# Altium schematic sheet BSheet3.SchDoc: =GlobalProjectName
size 209 x 297 mm; ApprovedBy: Утвердил; CheckedBy: Проверил; Author: Разработал; SheetNumber: 24; SheetTotal: 26; PageSetup: Record=PageOptions|CenterHorizontal=True|CenterVertical=True|PrintScale=1.00|XCorrection=1.00|YCorrection=1.00|PrintKind=1|BorderSize=5000000|LeftOffset=0|BottomOffset=0|Orientation=2|PaperLength=1000|PaperWidth=1000|Scale=100|PaperSource=15|PrintQuality=1200|MediaType=1|DitherType=10|PaperKind=A3|PrintScaleMode=1; Weight: -; ScaleFactor: -; NormInspection: Норм.Контр.
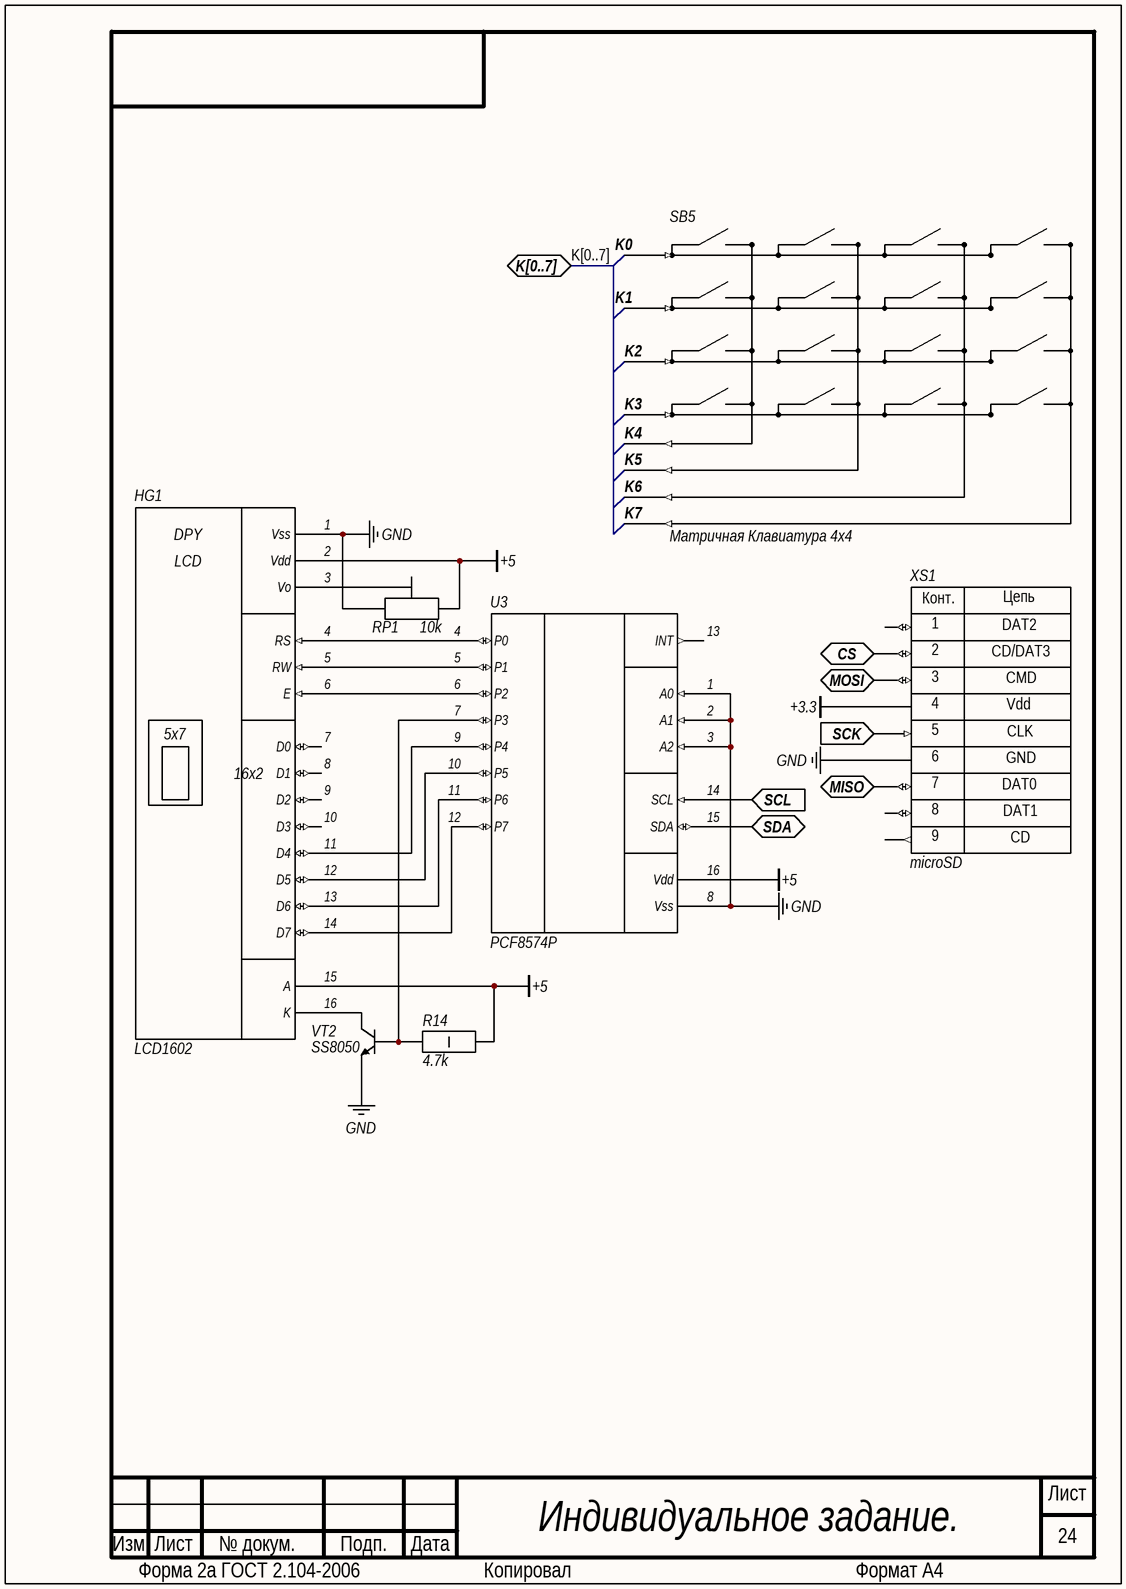
[diagram p0: BSheet3.SchDoc]

## Parts
HG1  LCD1602  [X PBS-16]
R14  4.7k  [R AXIAL-1W]
RP1  10k  [R ADJ-3296W]
SB5  Матричная Клавиатура 4x4  [X PLS-8]
U3  PCF8574P  [U DIP-16]
VT2  SS8050  [VT TO-92]
XS1  microSD  [X microSD]

## Ports
CS (bidir), K[0..7] (bidir), MISO (bidir), MOSI (bidir), SCK (in), SCL (in), SDA (bidir)

## Nets
+3.3: XS1.4(Vdd)
+5: HG1.2(Vdd) HG1.15(A) R14.1 RP1.1 U3.16(Vdd)
GND: HG1.1(Vss) RP1.3 U3.1(A0) U3.2(A1) U3.3(A2) U3.8(Vss) VT2.1(E) XS1.6(GND)
CS: XS1.2(CD/DAT3) ; port CS
K0: SB5.1
K1: SB5.2
K2: SB5.3
K3: SB5.4
K4: SB5.5
K5: SB5.6
K6: SB5.7
K7: SB5.8
MISO: XS1.7(DATA0) ; port MISO
MOSI: XS1.3(CMD) ; port MOSI
SCK: XS1.5(CLK) ; port SCK
SCL: U3.14(SCL) ; port SCL
SDA: U3.15(SDA) ; port SDA
NetHG1_3: HG1.3(Vo) RP1.2
NetHG1_4: HG1.4(RS) U3.4(P0)
NetHG1_5: HG1.5(RW) U3.5(P1)
NetHG1_6: HG1.6(E) U3.6(P2)
NetHG1_11: HG1.11(D4) U3.9(P4)
NetHG1_12: HG1.12(D5) U3.10(P5)
NetHG1_13: HG1.13(D6) U3.11(P6)
NetHG1_14: HG1.14(D7) U3.12(P7)
NetHG1_16: HG1.16(K) VT2.3(C)
NetR14_2: R14.2 U3.7(P3) VT2.2(B)

Not connected (* = marked no-connect by the designer): HG1 7(D0) 8(D1) 9(D2) 10(D3); U3 13(INT); XS1 1(DAT2) 8(DATA1)

## Buses and harness runs
bus K[0..7] = port K[0..7]

## Notes on the sheet
- Индивидуальное задание.
- Изм.
- Лист
- № докум.
- Подп.
- Дата
- Форма 2а ГОСТ 2.104-2006
- Копировал
- Формат А4
- (in symbol LCD HD44780) DPY
- (in symbol microSD) Цепь; Конт.; DAT0; DAT1; 9

## Library data of the parts
HG1 = LCD HD44780: Дисплей на основе контроллера HD44780.; ScreenResolution: 16x2; CharacterResolution: 5x7; Model: LCD1602; Manufacturer: *; Type: LCD; ComponentLink1Description: Store; ComponentLink1URL: *; ComponentLink2Description: Datasheet; ComponentLink2URL: *; ComponentLink3Description: HelpURL; ComponentLink3URL: *
R14 = Резистор 1 Вт: Model: CF-1W-4K7J; Power: 1; Case: Axial; Manufacturer: *; ComponentLink1Description: Datasheet; ComponentLink1URL: *; ComponentLink2Description: HelpURL; ComponentLink2URL: *; Value: 4.7k; ComponentLink3Description: Store; ComponentLink3URL: https://www.chipdip.ru/product0/1122?from=suggest_product
RP1 = Подстроечный Резистор: Case: *; Manufacturer: *; Model: *; ComponentLink1Description: Datasheet; ComponentLink1URL: *; ComponentLink2Description: HelpURL; ComponentLink2URL: *; Value: 10k; Power: *; ComponentLink3Description: Store; ComponentLink3URL: *
U3 = PCF8574: IIC расширитель.; Model: PCF8574P; Manufacturer: *; Case: *; ComponentLink1Description: Datasheet №1; ComponentLink1URL: https://www.nxp.com/docs/en/data-sheet/PCF8574_PCF8574A.pdf; ComponentLink2Description: Datasheet №2; ComponentLink2URL: http://www.ti.com/lit/ds/symlink/pcf8574.pdf; ComponentLink3Description: HelpURL; ComponentLink3URL: *; ComponentLink4Description: Store; ComponentLink4URL: *
VT2 = Биполярный Транзистор: Model: SS8050; Manufacturer: *; Case: *; ComponentLink1Description: Datasheet; ComponentLink1URL: *; ComponentLink2Description: HelpURL; ComponentLink2URL: *; ComponentLink3Description: Store; ComponentLink3URL: *
XS1 = microSD: Слот для карты памяти.; Manufacturer: Molex; TypeConnector: microSD; Model: *; ComponentLink1Description: Store; ComponentLink1URL: *; ComponentLink2Description: Datasheet; ComponentLink2URL: *; ComponentLink3Description: HelpURL; ComponentLink3URL: https://kicad-info.s3-us-west-2.amazonaws.com/original/2X/8/8d1dbfabaa90b65dad4965a185d7e55230d35003.png